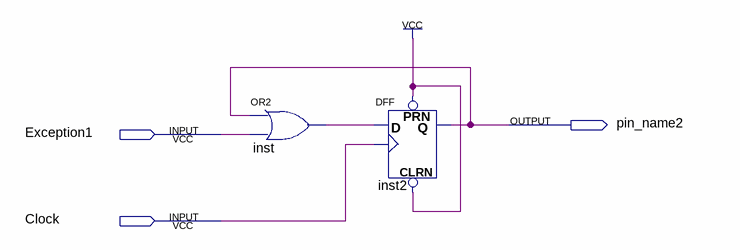
[diagram p0: schematic sheet]
// Quartus schematic Exception.bdf as structural Verilog: 2 symbols, 3 pins
module Exception (
  input  Exception1,
  input  Clock,
  output pin_name2
);

  wire inst_out;

  or inst (inst_out, pin_name2, Exception1);
  DFF inst2 (.CLRN(1'b1), .CLK(Clock), .D(inst_out), .PRN(1'b1), .Q(pin_name2));
endmodule
